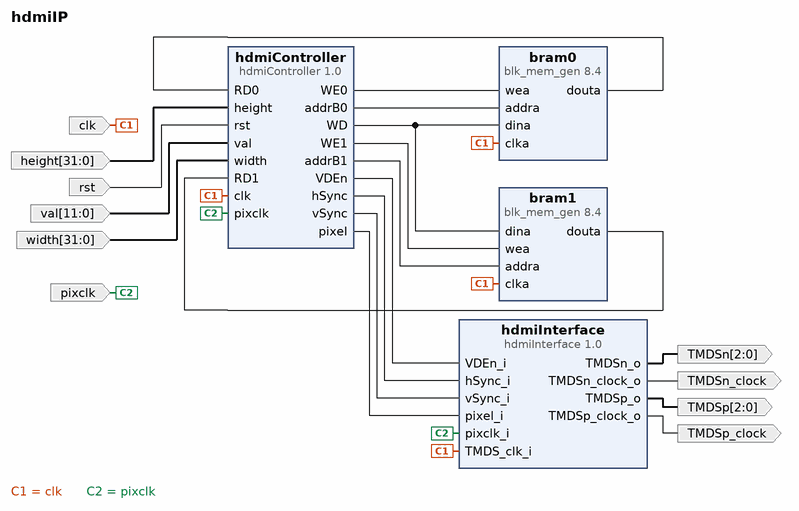
[diagram p0: block diagram of the top level]
# Vivado block design hdmiIP, xc7z010clg400-1, Vivado 2019.2
create_bd_design hdmiIP

create_bd_port -dir O -from 2 -to 0 TMDSp
create_bd_port -dir O -from 2 -to 0 TMDSn
create_bd_port -dir O TMDSp_clock
create_bd_port -dir O TMDSn_clock
create_bd_port -dir I -type clk clk
create_bd_port -dir I -from 31 -to 0 height
create_bd_port -dir I pixclk
create_bd_port -dir I -type rst rst
create_bd_port -dir I -from 11 -to 0 val
create_bd_port -dir I -from 31 -to 0 width

create_bd_cell -type ip -vlnv user.org:user:hdmiInterface:1.0 hdmiInterface
create_bd_cell -type ip -vlnv xilinx.com:ip:blk_mem_gen:8.4 bram0
set_property -dict [list \
  CONFIG.Enable_32bit_Address false \
  CONFIG.Enable_A Always_Enabled \
  CONFIG.Read_Width_A 1 \
  CONFIG.Register_PortA_Output_of_Memory_Primitives false \
  CONFIG.Use_Byte_Write_Enable false \
  CONFIG.Use_RSTA_Pin false \
  CONFIG.Write_Depth_A 307200 \
  CONFIG.Write_Width_A 1 \
  CONFIG.use_bram_block Stand_Alone \
] [get_bd_cells bram0]
create_bd_cell -type ip -vlnv xilinx.com:ip:blk_mem_gen:8.4 bram1
set_property -dict [list \
  CONFIG.Enable_32bit_Address false \
  CONFIG.Enable_A Always_Enabled \
  CONFIG.Read_Width_A 1 \
  CONFIG.Register_PortA_Output_of_Memory_Primitives false \
  CONFIG.Use_Byte_Write_Enable false \
  CONFIG.Use_RSTA_Pin false \
  CONFIG.Write_Depth_A 307200 \
  CONFIG.Write_Width_A 1 \
  CONFIG.use_bram_block Stand_Alone \
] [get_bd_cells bram1]
create_bd_cell -type ip -vlnv user.org:user:hdmiController:1.0 hdmiController

# ---- connections ----

connect_bd_net -net hdmiController_0_VDEn [get_bd_pins hdmiController/VDEn] [get_bd_pins hdmiInterface/VDEn_i]
connect_bd_net -net hdmiController_0_hSync [get_bd_pins hdmiController/hSync] [get_bd_pins hdmiInterface/hSync_i]
connect_bd_net -net hdmiController_0_vSync [get_bd_pins hdmiController/vSync] [get_bd_pins hdmiInterface/vSync_i]
connect_bd_net -net hdmiController_0_pixel [get_bd_pins hdmiController/pixel] [get_bd_pins hdmiInterface/pixel_i]
connect_bd_net -net hdmiController_0_WE0 [get_bd_pins hdmiController/WE0] [get_bd_pins bram0/wea]
connect_bd_net -net hdmiController_0_addrB0 [get_bd_pins hdmiController/addrB0] [get_bd_pins bram0/addra]
connect_bd_net -net hdmiController_0_WE1 [get_bd_pins hdmiController/WE1] [get_bd_pins bram1/wea]
connect_bd_net -net hdmiController_0_addrB1 [get_bd_pins hdmiController/addrB1] [get_bd_pins bram1/addra]
connect_bd_net -net hdmiController_0_WD [get_bd_pins hdmiController/WD] [get_bd_pins bram0/dina] [get_bd_pins bram1/dina]
connect_bd_net -net blk_mem_gen_1_douta [get_bd_pins bram1/douta] [get_bd_pins hdmiController/RD1]
connect_bd_net -net blk_mem_gen_0_douta [get_bd_pins bram0/douta] [get_bd_pins hdmiController/RD0]
connect_bd_net -net hdmiInterface_0_TMDSp_o [get_bd_pins hdmiInterface/TMDSp_o] [get_bd_ports TMDSp]
connect_bd_net -net hdmiInterface_0_TMDSn_o [get_bd_pins hdmiInterface/TMDSn_o] [get_bd_ports TMDSn]
connect_bd_net -net hdmiInterface_0_TMDSp_clock_o [get_bd_pins hdmiInterface/TMDSp_clock_o] [get_bd_ports TMDSp_clock]
connect_bd_net -net hdmiInterface_0_TMDSn_clock_o [get_bd_pins hdmiInterface/TMDSn_clock_o] [get_bd_ports TMDSn_clock]
connect_bd_net -net clk_0_1 [get_bd_ports clk] \
  [get_bd_pins hdmiInterface/TMDS_clk_i] [get_bd_pins bram0/clka] [get_bd_pins bram1/clka] [get_bd_pins hdmiController/clk]
connect_bd_net -net height_0_1 [get_bd_ports height] [get_bd_pins hdmiController/height]
connect_bd_net -net pixclk_0_1 [get_bd_ports pixclk] [get_bd_pins hdmiInterface/pixclk_i] [get_bd_pins hdmiController/pixclk]
connect_bd_net -net rst_0_1 [get_bd_ports rst] [get_bd_pins hdmiController/rst]
connect_bd_net -net val_0_1 [get_bd_ports val] [get_bd_pins hdmiController/val]
connect_bd_net -net width_0_1 [get_bd_ports width] [get_bd_pins hdmiController/width]

validate_bd_design
save_bd_design
